# EasyEDA Pro project Space_Hexapod.eprj, schematic SpaceHexapod
Board Name: Board1; Create Date: 2025-01-24
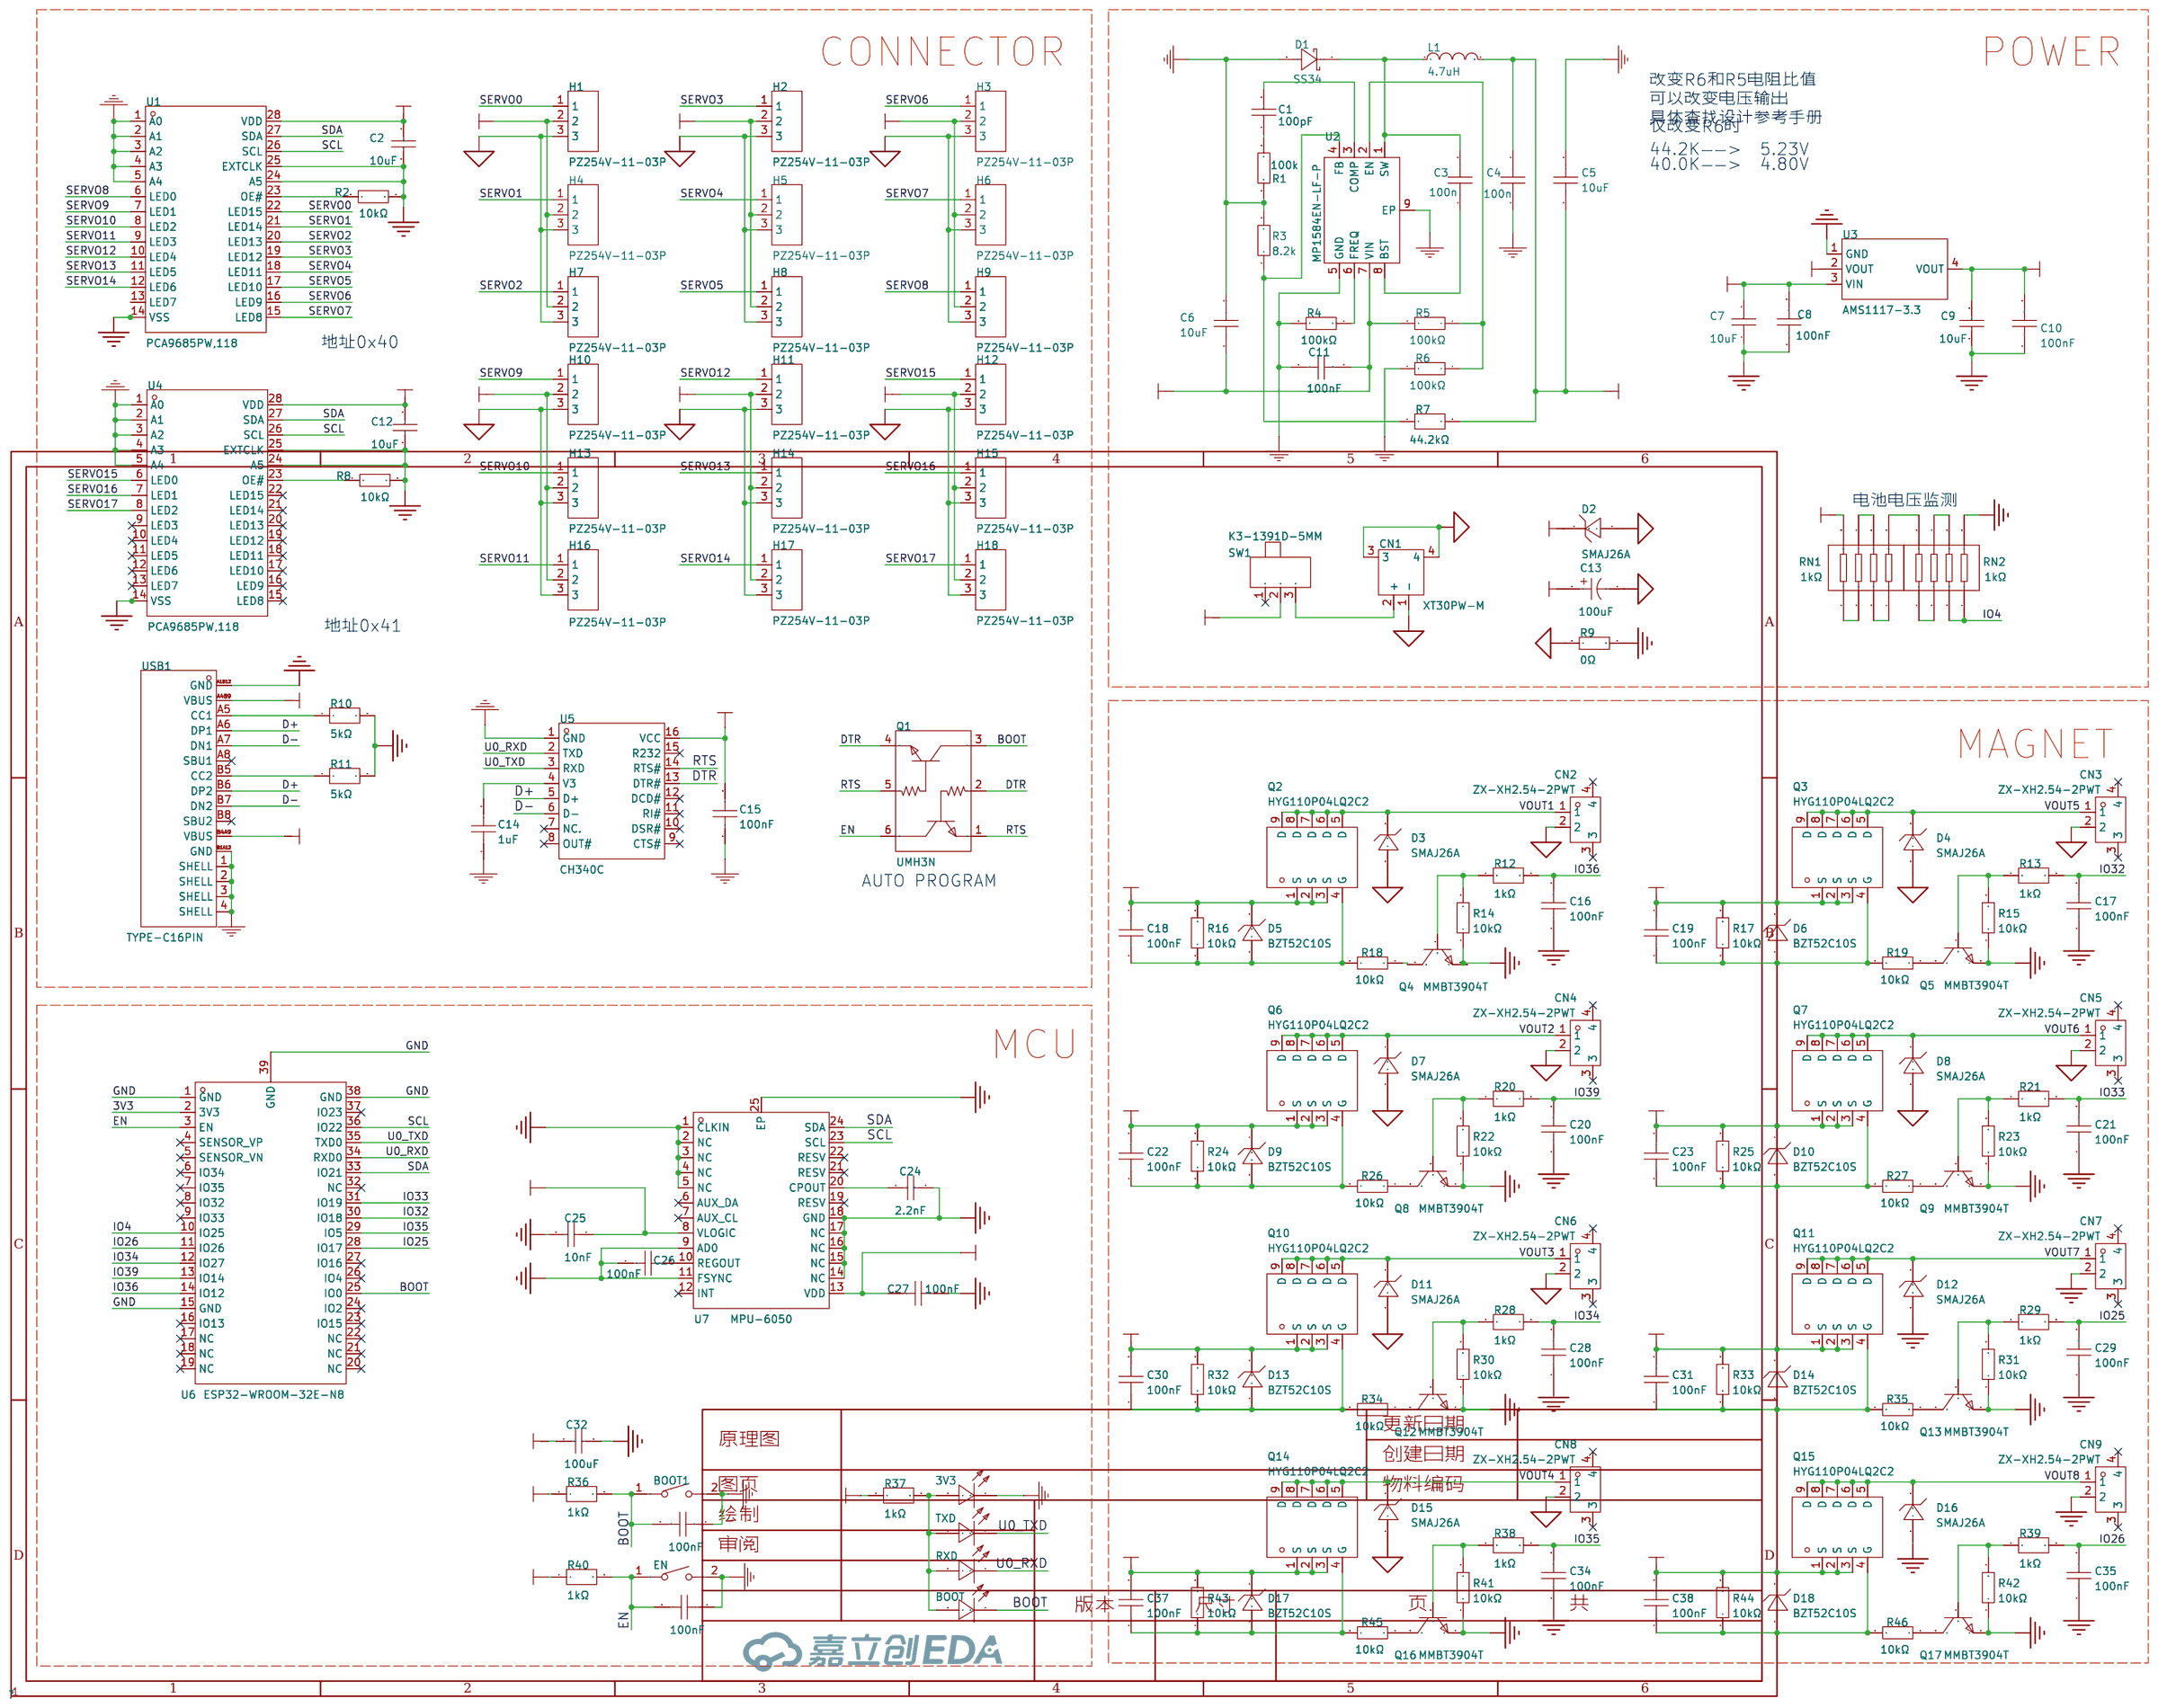
[diagram p0: schematic sheet]

## Parts
3V3  NCD0402G1  [LED0402-RD]
BOOT  NCD0402G1  [LED0402-RD]
BOOT1  TS-1088-AR02016  [SW-SMD_L3.9-W3.0-P4.45]
C1  100pF  [C0402]
C2  10uF  [C0402]
C3  100n  [C0402]
C4  100n  [C0402]
C5  10uF  [C1206]
C6  10uF  [C1206]
C7  10uF  [C0402]
C8  100nF  [C0402]
C9  10uF  [C0402]
C10  100nF  [C0402]
C11  100nF  [C0402]
C12  10uF  [C0402]
C13  100uF  [CAP-SMD_BD6.3-L6.6-W6.6-LS7.6-FD-1]
C14  1uF  [C0402]
C15  100nF  [C0402]
C16  100nF  [C0402]
C17  100nF  [C0402]
C18  100nF  [C0402]
C19  100nF  [C0402]
C20  100nF  [C0402]
C21  100nF  [C0402]
C22  100nF  [C0402]
C23  100nF  [C0402]
C24  2.2nF  [C0402]
C25  10nF  [C0402]
C26  100nF  [C0402]
C27  100nF  [C0402]
C28  100nF  [C0402]
C29  100nF  [C0402]
C30  100nF  [C0402]
C31  100nF  [C0402]
C32  100uF  [C1206]
C33  100nF  [C0402]
C34  100nF  [C0402]
C35  100nF  [C0402]
C36  100nF  [C0402]
C37  100nF  [C0402]
C38  100nF  [C0402]
CN1  XT30PW-M  [CONN-TH_XT30PW-M]
CN2  ZX-XH2.54-2PWT  [CONN-SMD_2P-P2.54_MEGASTAR_ZX-XH2.54-2PWT]
CN3  ZX-XH2.54-2PWT  [CONN-SMD_2P-P2.54_MEGASTAR_ZX-XH2.54-2PWT]
CN4  ZX-XH2.54-2PWT  [CONN-SMD_2P-P2.54_MEGASTAR_ZX-XH2.54-2PWT]
CN5  ZX-XH2.54-2PWT  [CONN-SMD_2P-P2.54_MEGASTAR_ZX-XH2.54-2PWT]
CN6  ZX-XH2.54-2PWT  [CONN-SMD_2P-P2.54_MEGASTAR_ZX-XH2.54-2PWT]
CN7  ZX-XH2.54-2PWT  [CONN-SMD_2P-P2.54_MEGASTAR_ZX-XH2.54-2PWT]
CN8  ZX-XH2.54-2PWT  [CONN-SMD_2P-P2.54_MEGASTAR_ZX-XH2.54-2PWT]
CN9  ZX-XH2.54-2PWT  [CONN-SMD_2P-P2.54_MEGASTAR_ZX-XH2.54-2PWT]
D1  SS34  [SMA_L4.2-W2.7-LS5.0-RD]
D2  SMAJ26A  [SMA_L4.3-W2.6-LS5.1-RD]
D3  SMAJ26A  [SMA_L4.3-W2.6-LS5.1-RD]
D4  SMAJ26A  [SMA_L4.3-W2.6-LS5.1-RD]
D5  BZT52C10S  [SOD-323_L1.6-W1.3-LS2.7-RD]
D6  BZT52C10S  [SOD-323_L1.6-W1.3-LS2.7-RD]
D7  SMAJ26A  [SMA_L4.3-W2.6-LS5.1-RD]
D8  SMAJ26A  [SMA_L4.3-W2.6-LS5.1-RD]
D9  BZT52C10S  [SOD-323_L1.6-W1.3-LS2.7-RD]
D10  BZT52C10S  [SOD-323_L1.6-W1.3-LS2.7-RD]
D11  SMAJ26A  [SMA_L4.3-W2.6-LS5.1-RD]
D12  SMAJ26A  [SMA_L4.3-W2.6-LS5.1-RD]
D13  BZT52C10S  [SOD-323_L1.6-W1.3-LS2.7-RD]
D14  BZT52C10S  [SOD-323_L1.6-W1.3-LS2.7-RD]
D15  SMAJ26A  [SMA_L4.3-W2.6-LS5.1-RD]
D16  SMAJ26A  [SMA_L4.3-W2.6-LS5.1-RD]
D17  BZT52C10S  [SOD-323_L1.6-W1.3-LS2.7-RD]
D18  BZT52C10S  [SOD-323_L1.6-W1.3-LS2.7-RD]
EN  TS-1088-AR02016  [SW-SMD_L3.9-W3.0-P4.45]
H1  PZ254V-11-03P  [HDR-TH_3P-P2.54-V-M]
H2  PZ254V-11-03P  [HDR-TH_3P-P2.54-V-M]
H3  PZ254V-11-03P  [HDR-TH_3P-P2.54-V-M]
H4  PZ254V-11-03P  [HDR-TH_3P-P2.54-V-M]
H5  PZ254V-11-03P  [HDR-TH_3P-P2.54-V-M]
H6  PZ254V-11-03P  [HDR-TH_3P-P2.54-V-M]
H7  PZ254V-11-03P  [HDR-TH_3P-P2.54-V-M]
H8  PZ254V-11-03P  [HDR-TH_3P-P2.54-V-M]
H9  PZ254V-11-03P  [HDR-TH_3P-P2.54-V-M]
H10  PZ254V-11-03P  [HDR-TH_3P-P2.54-V-M]
H11  PZ254V-11-03P  [HDR-TH_3P-P2.54-V-M]
H12  PZ254V-11-03P  [HDR-TH_3P-P2.54-V-M]
H13  PZ254V-11-03P  [HDR-TH_3P-P2.54-V-M]
H14  PZ254V-11-03P  [HDR-TH_3P-P2.54-V-M]
H15  PZ254V-11-03P  [HDR-TH_3P-P2.54-V-M]
H16  PZ254V-11-03P  [HDR-TH_3P-P2.54-V-M]
H17  PZ254V-11-03P  [HDR-TH_3P-P2.54-V-M]
H18  PZ254V-11-03P  [HDR-TH_3P-P2.54-V-M]
L1  4.7uH  [IND-SMD_L5.9-W5.2]
Q1  UMH3N  [SC-70-6_L2.2-W1.3-P0.65-LS2.1-BR]
Q2  HYG110P04LQ2C2  [PDFN-8_L5.2-W5.9-P1.27-LS6.2-BL]
Q3  HYG110P04LQ2C2  [PDFN-8_L5.2-W5.9-P1.27-LS6.2-BL]
Q4  MMBT3904T  [SOT-523-3_L1.6-W0.8-P1.00-LS1.6-BR]
Q5  MMBT3904T  [SOT-523-3_L1.6-W0.8-P1.00-LS1.6-BR]
Q6  HYG110P04LQ2C2  [PDFN-8_L5.2-W5.9-P1.27-LS6.2-BL]
Q7  HYG110P04LQ2C2  [PDFN-8_L5.2-W5.9-P1.27-LS6.2-BL]
Q8  MMBT3904T  [SOT-523-3_L1.6-W0.8-P1.00-LS1.6-BR]
Q9  MMBT3904T  [SOT-523-3_L1.6-W0.8-P1.00-LS1.6-BR]
Q10  HYG110P04LQ2C2  [PDFN-8_L5.2-W5.9-P1.27-LS6.2-BL]
Q11  HYG110P04LQ2C2  [PDFN-8_L5.2-W5.9-P1.27-LS6.2-BL]
Q12  MMBT3904T  [SOT-523-3_L1.6-W0.8-P1.00-LS1.6-BR]
Q13  MMBT3904T  [SOT-523-3_L1.6-W0.8-P1.00-LS1.6-BR]
Q14  HYG110P04LQ2C2  [PDFN-8_L5.2-W5.9-P1.27-LS6.2-BL]
Q15  HYG110P04LQ2C2  [PDFN-8_L5.2-W5.9-P1.27-LS6.2-BL]
Q16  MMBT3904T  [SOT-523-3_L1.6-W0.8-P1.00-LS1.6-BR]
Q17  MMBT3904T  [SOT-523-3_L1.6-W0.8-P1.00-LS1.6-BR]
R1  100k  [R0402]
R2  10kΩ  [R0402]
R3  8.2k  [R0402]
R4  100kΩ  [R0402]
R5  100kΩ  [R0402]
R6  100kΩ  [R0402]
R7  44.2kΩ  [R0402]
R8  10kΩ  [R0402]
R9  0Ω  [R0402]
R10  5kΩ  [R0402]
R11  5kΩ  [R0402]
R12  1kΩ  [R0402]
R13  1kΩ  [R0402]
R14  10kΩ  [R0402]
R15  10kΩ  [R0402]
R16  10kΩ  [R0402]
R17  10kΩ  [R0402]
R18  10kΩ  [R0402]
R19  10kΩ  [R0402]
R20  1kΩ  [R0402]
R21  1kΩ  [R0402]
R22  10kΩ  [R0402]
R23  10kΩ  [R0402]
R24  10kΩ  [R0402]
R25  10kΩ  [R0402]
R26  10kΩ  [R0402]
R27  10kΩ  [R0402]
R28  1kΩ  [R0402]
R29  1kΩ  [R0402]
R30  10kΩ  [R0402]
R31  10kΩ  [R0402]
R32  10kΩ  [R0402]
R33  10kΩ  [R0402]
R34  10kΩ  [R0402]
R35  10kΩ  [R0402]
R36  1kΩ  [R0402]
R37  1kΩ  [R0402]
R38  1kΩ  [R0402]
R39  1kΩ  [R0402]
R40  1kΩ  [R0402]
R41  10kΩ  [R0402]
R42  10kΩ  [R0402]
R43  10kΩ  [R0402]
R44  10kΩ  [R0402]
R45  10kΩ  [R0402]
R46  10kΩ  [R0402]
RN1  1kΩ  [RES-ARRAY-SMD_0603-8P-L3.2-W1.6-BL]
RN2  1kΩ  [RES-ARRAY-SMD_0603-8P-L3.2-W1.6-BL]
RXD  NCD0402G1  [LED0402-RD]
SW1  K3-1391D-5MM  [SW-TH_K3-1391D-5MM]
TXD  NCD0402G1  [LED0402-RD]
U1  PCA9685PW,118  [TSSOP-28_L9.7-W4.4-P0.65-LS6.4-TL]
U2  MP1584EN-LF-P  [SOIC-8_L4.9-W3.9-P1.27-LS6.0-TL-EP-1]
U3  AMS1117-3.3  [SOT-223-3_L6.5-W3.4-P2.30-LS7.0-BR]
U4  PCA9685PW,118  [TSSOP-28_L9.7-W4.4-P0.65-LS6.4-TL]
U5  CH340C  [SOP-16_L10.0-W3.9-P1.27-LS6.0-BL]
U6  ESP32-WROOM-32E-N8  [WIFI-SMD_ESP32-WROOM-32E]
U7  MPU-6050  [QFN-24_L4.0-W4.0-P0.50-BL-EP2.7]
USB1  TYPE-C16PIN  [USB-C-SMD_TYPE-C16PIN]

## Library data of the parts
3V3 BOOT RXD TXD = NCD0402G1: Supplier Part: C130723; Manufacturer: 国星光电; Supplier Footprint: 0402; JLCPCB Part Class: 扩展库; Datasheet: https://atta.szlcsc.com/upload/public/pdf/source/20200820/C130723_D39B4171A1B8D8D2F39C1DC521C0922A.pdf; Supplier: LCSC; Emitted Color: 翠绿色; Forward Voltage (VF): 2.6V~3.6V; Power Dissipation: 72mW; Forward Current: 5mA; Dominant Wavelength: 515nm~530nm; Lens Color: 无色透明透镜; Luminous Intensity: 100mcd~270mcd; Viewing Angle: 130°; Operating Temperature: -30℃~+85℃
BOOT1 EN = TS-1088-AR02016: 电路结构:单刀单掷;按钮形状:圆形按钮;作用力:160gf;安装方式:立贴;开关长度:4mm;开关宽度:3mm;开关高度:2mm;带支架:不带;触点电流:50mA;额定电压(DC):12V;绝缘电阻:100MΩ;机械寿命:10万次;; LCSC Part Name: 4*3*2mm 立贴 轻触开关; Supplier Part: C720477; Manufacturer: XUNPU(讯普); Supplier Footprint: SMD; JLCPCB Part Class: 扩展库; Datasheet: https://atta.szlcsc.com/upload/public/pdf/source/20200810/C720475_60D09DD6C54279ADDB2DC25100F1CC11.pdf; Supplier: LCSC; Circuit: 单刀单掷; Actuator Style: 圆形按钮; Operating Force: 160gf; Mounting Style: 立贴; Switch Length: 4mm; Switch Width: 3mm; Switch Height: 2mm; Strike Gundam: 不带; Contact Current: 50mA; Voltage Rating (DC): 12V; Insulation Resistance: 100MΩ; Actuator/Cap Color: 黑色; Pin Style: SMD接片; Mechanical Life: 10万次; Operating Temperature: -30℃~+80℃
C1 = GRM1555C1H101JA01D: LCSC Part Name: 100pF ±5% 50V; Supplier Part: C77177; Manufacturer: muRata(村田); Supplier Footprint: 0402; JLCPCB Part Class: 扩展库; Datasheet: https://atta.szlcsc.com/upload/public/pdf/source/20161108/1478586482814.pdf; Supplier: LCSC; Tolerance: ±5%; Voltage Rated: 50V; Temperature Coefficient: C0G
C2 C7 C9 C12 = CL05A106MQ5NUNC: 容值:10uF;精度:±20%;额定电压:6.3V;材质(温度系数):X5R;; LCSC Part Name: 10uF ±20% 6.3V; Supplier Part: C15525; Manufacturer: SAMSUNG(三星); Supplier Footprint: 0402; JLCPCB Part Class: 基础库; Datasheet: https://atta.szlcsc.com/upload/public/pdf/source/20220823/2B02EE04F8F211D38A52DCB16EB6BEBA.pdf; Supplier: LCSC; Tolerance: ±20%; Voltage Rated: 6.3V; Temperature Coefficient: X5R
C3 C4 C11 C15-C23 C26-C31 C34 C35 C37 C38 = CL05B104KB54PNC: LCSC Part Name: 100nF ±10% 50V; Supplier Part: C307331; Manufacturer: SAMSUNG(三星); Supplier Footprint: 0402; JLCPCB Part Class: 基础库; Datasheet: https://atta.szlcsc.com/upload/public/pdf/source/20160218/1457707763339.pdf; Supplier: LCSC; Tolerance: ±10%; Voltage Rated: 50V; Temperature Coefficient: X7R
C5 C6 = HGC1206R5106K500NSPJ: LCSC Part Name: 10uF ±10% 50V; Supplier Part: C7432781; Manufacturer: Chinocera(华瓷); Supplier Footprint: 1206; JLCPCB Part Class: 扩展库; Datasheet: https://atta.szlcsc.com/upload/public/pdf/source/20240320/FAC3FEC40A78BC5CCCE96C232A94D860.pdf; Supplier: LCSC; Tolerance: ±10%; Voltage Rating: 50V; Temperature Coefficient: X5R
C8 C10 C33 C36 = CC0402KRX7R7BB104: 容值:100nF;精度:±10%;额定电压:16V;材质(温度系数):X7R;; LCSC Part Name: 100nF ±10% 16V; Supplier Part: C60474; Manufacturer: YAGEO(国巨); Supplier Footprint: 0402; JLCPCB Part Class: 扩展库; Datasheet: https://atta.szlcsc.com/upload/public/pdf/source/20211223/9278FD768280B81DDBEF48FA36411A03.pdf; Supplier: LCSC; Tolerance: ±10%; Voltage Rated: 16V; Temperature Coefficient: X7R
C13 = RVE100UF35V67RV0072: LCSC Part Name: 100uF ±20% 35V; Supplier Part: C2836437; Manufacturer: KNSCHA(科尼盛); Supplier Footprint: SMD,D6.3xL7.7mm; JLCPCB Part Class: 扩展库; Datasheet: https://atta.szlcsc.com/upload/public/pdf/source/20220719/B52EB46F8A1558448ED03D8B4CB3C24F.pdf; Supplier: LCSC; Tolerance: ±20%; Rated Voltage: 35V; Ripple Current: 230mA@120Hz; Equivalent Series Resistance(ESR): 600mΩ@100kHz; φD: 6.3mm; L: 7.7mm; Lifetime @ Temp: 2000hrs@105℃; Operating Temperature: -55℃~+105℃
C14 = GRM155R61H105KE05D: LCSC Part Name: 1uF ±10% 50V; Supplier Part: C1518208; Manufacturer: muRata(村田); Supplier Footprint: 0402; JLCPCB Part Class: 扩展库; Datasheet: https://atta.szlcsc.com/upload/public/pdf/source/20210607/3F03D47137F6EC7729AB4067EB2A6EB3.pdf; Supplier: LCSC; Tolerance: ±10%; Voltage Rated: 50V; Temperature Coefficient: X5R
C24 = CC0402KRX7R9BB222: LCSC Part Name: 2.2nF ±10% 50V; Supplier Part: C106861; Manufacturer: YAGEO(国巨); Supplier Footprint: 0402; JLCPCB Part Class: 扩展库; Datasheet: https://atta.szlcsc.com/upload/public/pdf/source/20170505/1493957848374.pdf; Supplier: LCSC; Tolerance: ±10%; Voltage Rated: 50V; Temperature Coefficient: X7R
C25 = CL05B103KB5NNNC: LCSC Part Name: 10nF ±10% 50V; Supplier Part: C15195; Manufacturer: SAMSUNG(三星); Supplier Footprint: 0402; JLCPCB Part Class: 基础库; Datasheet: https://atta.szlcsc.com/upload/public/pdf/source/20160218/1457707763339.pdf; Supplier: LCSC; Tolerance: ±10%; Voltage Rated: 50V; Temperature Coefficient: X7R
C32 = CL31A107MQHNNNE: LCSC Part Name: 100uF ±20% 6.3V; Supplier Part: C15008; Manufacturer: SAMSUNG(三星); Supplier Footprint: 1206; JLCPCB Part Class: 基础库; Datasheet: https://atta.szlcsc.com/upload/public/pdf/source/20160218/1457707763339.pdf; Supplier: LCSC; Tolerance: ±20%; Voltage Rated: 6.3V; Temperature Coefficient: X5R
CN1 = XT30PW-M: Socket,DCsupply,XT30,male,PIN:2; LCSC Part Name: XT30PW-M公头; Supplier Part: C431092; Manufacturer: AMASS(艾迈斯); Supplier Footprint: 插件; JLCPCB Part Class: 扩展库; Datasheet: https://atta.szlcsc.com/upload/public/pdf/source/20220222/6A9F22F7850E25B33E1BE430ADF8560B.pdf; Supplier: LCSC
CN2-CN9 = ZX-XH2.54-2PWT: LCSC Part Name: 1x2P 间距:2.5mm 卧贴 系列:XH; Supplier Part: C7429671; Manufacturer: Megastar(兆星); Supplier Footprint: SMD,P=2.5mm,卧贴; JLCPCB Part Class: 扩展库; Datasheet: https://atta.szlcsc.com/upload/public/pdf/source/20230619/D2020A0565D707024C90AEAD14B7AF42.pdf; Supplier: LCSC; Pins Structure: 1x2P; Pitch: 2.5mm; Mounting Type: 卧贴; Reference Series: XH; Number of Pins: 2P; Number of Rows: 1; Number of PINs Per Row: 2; Contact Material: 黄铜; Contact Plating: 锡; Supplementary Features: 辅助焊脚; Color: 米色; Z-Height of the Board: 6.2mm; X-Length of Bottom Edge on Board (Spacing Line): 10mm; Y-Width of Bottom Edge on Board: 10.5mm
D1 = SS34_C2891718: LCSC Part Name: 电压:40V 电流:3A; Supplier Part: C2891718; Manufacturer: KUU; Supplier Footprint: SMA(DO-214AC); JLCPCB Part Class: 扩展库; Datasheet: https://atta.szlcsc.com/upload/public/pdf/source/20210901/43FECDC7C0D2D5B6002302D3612B6747.pdf; Supplier: LCSC; Forward Voltage (Vf@If): 550mV@3A; Reverse Voltage (Vr): 40V; Average Rectified Current (Io): 3A; Reverse Leakage Current (Ir): 500uA@40V
D2-D4 D7 D8 D11 D12 D15 D16 = SMAJ26A_C2848697: 反向截止电压(Vrwm):26V;最大钳位电压:42.1V;峰值脉冲电流(Ipp)@10/1000us:9.5A;击穿电压:28.9V;; LCSC Part Name: 单向TVS 26V截止 9.5A峰值脉冲; Supplier Part: C2848697; Manufacturer: GOODWORK(固得沃克); Supplier Footprint: SMA(DO-214AC); JLCPCB Part Class: 扩展库; Datasheet: https://atta.szlcsc.com/upload/public/pdf/source/20201231/C908757_5436EAF671B686EFC2F0DD2098F0ED89.pdf; Supplier: LCSC; Reverse Stand-Off Voltage (Vrwm): 26V; Maximum Clamping Voltage: 42.1V; Peak Pulse Current (Ipp)@10/1000us: 9.5A; Breakdown Voltage: 28.9V; Reverse Leakage Current (Ir): 5uA; Type: TVS; Check: false
D5 D6 D9 D10 D13 D14 D17 D18 = BZT52C10S_C353563: 二极管配置:独立式;稳压值(标称值):10V;稳压值(范围):9.4V~10.6V;功率:200mW;精度:-;; LCSC Part Name: 齐纳二极管 10V 200mW; Supplier Part: C353563; Manufacturer: 晶导微电子; Supplier Footprint: SOD-323; JLCPCB Part Class: 扩展库; Datasheet: https://atta.szlcsc.com/upload/public/pdf/source/20190315/C353563_3561759C765052AF368552CF3A49B126.pdf; Supplier: LCSC; Diode Configuration: 独立式; Zener Voltage (Nom): 10V; Reverse Leakage Current (Ir): 200nA@7V; Zener Voltage (Range): 9.4V~10.6V; Power Dissipation: 200mW; Zener Impedance (Zzt): 20Ω; Check: false
H1-H18 = PZ254V-11-03P: LCSC Part Name: 间距:2.54mm 1x3P 直插 方针; Supplier Part: C2937625; Manufacturer: XFCN(兴飞); Supplier Footprint: 插件,P=2.54mm; JLCPCB Part Class: 扩展库; Datasheet: https://atta.szlcsc.com/upload/public/pdf/source/20200309/C492402_8335C3D49C4E4C618838D59BB1D024C1.pdf; Supplier: LCSC; Pin Structure: 1x3P; Pitch: 2.54mm; Circluar Pins/Square Pins: 方针; Mounting Type: 直插; Number of Rows: 单排; Number of Pins: 3P; Current Rating (Max): 3A; Voltage Rating (Max): 250V; Length of Mating Pin: 6mm; Insulation Height: 2.5mm; Length of End Connection Pin: 3mm; Operating Temperature Range: -40℃~+105℃; Color: 黑色
L1 = MAPM0530F-4R7M-LF: LCSC Part Name: 4.7uH ±20%; Supplier Part: C696442; Manufacturer: microgate(麦捷科技); Supplier Footprint: SMD,5.2x5.9mm; JLCPCB Part Class: 扩展库; Datasheet: https://atta.szlcsc.com/upload/public/pdf/source/20200708/C696439_8685B867A9A56AADDA2217A0E77F6DD4.pdf; Supplier: LCSC; Tolerance: ±20%; Rated Current: 3A; DC Resistance (DCR): 85mΩ
Q1 = UMH3N: LCSC Part Name: 耐压:50V 电流:100mA; Supplier Part: C62892; Manufacturer: CJ(江苏长电/长晶); Supplier Footprint: SC-70-6(SOT-363); JLCPCB Part Class: 扩展库; Datasheet: https://atta.szlcsc.com/upload/public/pdf/source/20151109/1457707575095.pdf; Supplier: LCSC; Collector-Emitter Breakdown Voltage (Vceo): 50V; Collector Current (Ic): 100mA; Power Dissipation (Pd): 150mW; DC Current Gain (hFE@Ic,Vce): 100@1mA,5V; Input Resistor: 6.11kΩ; Operating Temperature: -55℃~+150℃
Q2 Q3 Q6 Q7 Q10 Q11 Q14 Q15 = HYG110P04LQ2C2: 类型:1个P沟道;漏源电压(Vdss):40V;连续漏极电流(Id):55A;功率(Pd):62.5W;导通电阻(RDS(on)@Vgs,Id):9mΩ@10V,20A;阈值电压(Vgs(th)@Id):1.6V@250uA;; LCSC Part Name: 1个P沟道 耐压:40V 电流:55A; Supplier Part: C2891580; Manufacturer: HUAYI(华羿微); Supplier Footprint: PDFN-8(5.9x5.2); JLCPCB Part Class: 扩展库; Datasheet: https://atta.szlcsc.com/upload/public/pdf/source/20210918/C2891580_F8AA530E8886F11C9EBC9E8EFD99D4C1.pdf; Supplier: LCSC; Type: 1个P沟道; Drain Source Voltage (Vdss): 40V; Continuous Drain Current (Id): 55A; Power Dissipation (Pd): 62.5W; Drain Source On Resistance (RDS(on)@Vgs,Id): 9mΩ@10V,20A; Gate Threshold Voltage (Vgs(th)@Id): 1.6V@250uA; Total Gate Charge (Qg@Vgs): 76nC@10V; Input Capacitance (Ciss@Vds): 4.468nF@25V; Reverse Transfer Capacitance (Crss@Vds): 140pF@25V; Operating Temperature: -55℃~+175℃@(Tj); Check: false
Q4 Q5 Q8 Q9 Q12 Q13 Q16 Q17 = MMBT3904T_C61616: 晶体管类型:NPN;集电极电流(Ic):200mA;集射极击穿电压(Vceo):40V;功率(Pd):250mW;; LCSC Part Name: MMBT3904T(RANGE:100-300) 100~300; Supplier Part: C61616; Manufacturer: CJ(江苏长电/长晶); Supplier Footprint: SOT-523-3; JLCPCB Part Class: 扩展库; Datasheet: https://atta.szlcsc.com/upload/public/pdf/source/20160713/1468379853547.pdf; Supplier: LCSC; Transistor Type: NPN; Collector Current (Ic): 200mA; Collector-Emitter Breakdown Voltage (Vceo): 40V; Power Dissipation (Pd): 250mW; Check: false
R1 R4-R6 = 0402WGF1003TCE: LCSC Part Name: 100kΩ ±1% 62.5mW 厚膜电阻; Supplier Part: C25741; Manufacturer: UNI-ROYAL(厚声); Supplier Footprint: 0402; JLCPCB Part Class: 基础库; Datasheet: https://atta.szlcsc.com/upload/public/pdf/source/20200306/C422600_1E6D84923E4A46A82E41ADD87F860B5C.pdf; Supplier: LCSC; Type: 厚膜电阻; Tolerance: ±1%; Power(Watts): 62.5mW; Overload Voltage (Max): 50V; Temperature Coefficient: ±100ppm/℃; Operating Temperature Range: -55℃~+155℃
R2 R8 R14-R19 R22-R27 R30-R35 R41-R46 = 0402WGF1002TCE: LCSC Part Name: 10kΩ ±1% 62.5mW 厚膜电阻; Supplier Part: C25744; Manufacturer: UNI-ROYAL(厚声); Supplier Footprint: 0402; JLCPCB Part Class: 基础库; Datasheet: https://atta.szlcsc.com/upload/public/pdf/source/20200306/C422600_1E6D84923E4A46A82E41ADD87F860B5C.pdf; Supplier: LCSC; Type: 厚膜电阻; Tolerance: ±1%; Power(Watts): 62.5mW; Overload Voltage (Max): 50V; Temperature Coefficient: ±100ppm/℃; Operating Temperature Range: -55℃~+155℃
R3 = 0402WGF8201TCE: LCSC Part Name: 8.2kΩ ±1% 62.5mW 厚膜电阻; Supplier Part: C25924; Manufacturer: UNI-ROYAL(厚声); Supplier Footprint: 0402; JLCPCB Part Class: 扩展库; Datasheet: https://atta.szlcsc.com/upload/public/pdf/source/20200306/C422600_1E6D84923E4A46A82E41ADD87F860B5C.pdf; Supplier: LCSC; Type: 厚膜电阻; Tolerance: ±1%; Power(Watts): 62.5mW; Overload Voltage (Max): 50V; Temperature Coefficient: ±100ppm/℃; Operating Temperature Range: -55℃~+155℃
R7 = FRC0402F4422TS: LCSC Part Name: 44.2kΩ ±1% 62.5mW 厚膜电阻; Supplier Part: C2933098; Manufacturer: FOJAN(富捷); Supplier Footprint: 0402; JLCPCB Part Class: 扩展库; Datasheet: https://atta.szlcsc.com/upload/public/pdf/source/20211221/925EC7D7225764EE0046F22065062C87.pdf; Supplier: LCSC; Type: 厚膜电阻; Tolerance: ±1%; Power(Watts): 62.5mW; Voltage-Supply(Max): 50V; Temperature Coefficient: ±100ppm/℃; Operating Temperature: -55℃~+155℃
R9 = 0402WGF0000TCE: LCSC Part Name: 0Ω ±1% 62.5mW 厚膜电阻; Supplier Part: C17168; Manufacturer: UNI-ROYAL(厚声); Supplier Footprint: 0402; JLCPCB Part Class: 基础库; Datasheet: https://atta.szlcsc.com/upload/public/pdf/source/20200306/C422600_1E6D84923E4A46A82E41ADD87F860B5C.pdf; Supplier: LCSC; Type: 厚膜电阻; Tolerance: ±1%; Power(Watts): 62.5mW; Overload Voltage (Max): 50V; Temperature Coefficient: ±800ppm/℃; Operating Temperature Range: -55℃~+155℃
R10 R11 = RC0402FR-075KL: LCSC Part Name: 厚膜电阻 5kΩ ±1% 62.5mW; Supplier Part: C477765; Manufacturer: YAGEO(国巨); Supplier Footprint: 0402; JLCPCB Part Class: 扩展库; Datasheet: https://atta.szlcsc.com/upload/public/pdf/source/20200715/C477765_7B5FC8325F065A7C97D0E958BF6567D2.pdf; Supplier: LCSC; Type: 厚膜电阻; Tolerance: ±1%; Power(Watts): 62.5mW; Overload Voltage (Max): 50V; Temperature Coefficient: ±100ppm/℃; Operating Temperature Range: -55℃~+155℃
R12 R13 R20 R21 R28 R29 R36-R40 = RT0402BRD071KL: LCSC Part Name: 薄膜电阻 1kΩ ±0.1% 62.5mW; Supplier Part: C852624; Manufacturer: YAGEO(国巨); Supplier Footprint: 0402; JLCPCB Part Class: 扩展库; Datasheet: https://atta.szlcsc.com/upload/public/pdf/source/20210609/C852624_9EB141A274604F87C6BB037C8019D50A.pdf; Supplier: LCSC; Type: 薄膜电阻; Tolerance: ±0.1%; Power(Watts): 62.5mW; Overload Voltage (Max): 50V; Temperature Coefficient: ±25ppm/℃; Operating Temperature Range: -55℃~+155℃
RN1 RN2 = RC-ML08W102JT: LCSC Part Name: 1kΩ ±5%; Supplier Part: C160614; Manufacturer: FH(风华); Supplier Footprint: 0603x4; JLCPCB Part Class: 扩展库; Datasheet: https://atta.szlcsc.com/upload/public/pdf/source/20140224/1457706855019.pdf; Supplier: LCSC; Number of Resistors: 4; Tolerance: ±5%; Power(Watts): 62.5mW; Temperature Coefficient: ±100ppm/℃; Number of Pins: 8
SW1 = K3-1391D-5MM: LCSC Part Name: 直插双档 滑动开关; Supplier Part: C970579; Manufacturer: 韩国韩荣; Supplier Footprint: 插件; JLCPCB Part Class: 扩展库; Datasheet: https://atta.szlcsc.com/upload/public/pdf/source/20201211/C970579_603CDB6D9DEEEE4ED10454FCD9A65E24.pdf; Supplier: LCSC; Circuit: 单刀双掷; Actuator Style: 矩形柱状; Pin Style: PC引脚; Switch Length: 13.3mm; Switch Width: 6mm; Switch Height: 6.6mm; Mounting Style: 直插; Actuator Color: 黑色; Current Rating (AC): 3A; Voltage Rating (AC): 120V; Mechanical Life: 3万次; Operating Temperature: -25℃~+80℃
U1 U4 = PCA9685PW,118: Supplier Part: C2678753; Manufacturer: NXP(恩智浦); Supplier Footprint: TSSOP-28; JLCPCB Part Class: 扩展库; Datasheet: https://atta.szlcsc.com/upload/public/pdf/source/20170908/C92206_1504870161626958140.pdf; Supplier: LCSC; Input Voltage: 2.3V~5.5V; Switch Frequency: 100kHz~1MHz; Channels: 16; Output Voltage: 5.5V; Output Current: 25mA; Dimming: PWM; Operating temperature: -40℃~+85℃
U2 = MP1584EN-LF-P: LCSC Part Name: 3A，1.5MHz，28V降压转换器; Supplier Part: C7304223; Manufacturer: MPS(芯源); Supplier Footprint: SOIC-8-EP; JLCPCB Part Class: 扩展库; Datasheet: https://atta.szlcsc.com/upload/public/pdf/source/20240130/9891F7686D244BAC2C15FBD735CECA53.pdf; Supplier: LCSC; Function: 降压型; Output Type: 可调; Input Voltage: 4.5V~28V; Output Voltage: 800mV~25V; Output Current: 3A; Switching Frequency: 1.5MHz; Operating Temperature: -20℃~+125℃@(TJ); Synchronous Rectification: 否; Number of Outputs: 1; Topology: 降压式; Switch tube (built-in/external): 内置
U3 = AMS1117-3.3_C6186: 输出类型:固定;最大输入电压:-;输出电压:3.3V;最大输出电流:1A;电源纹波抑制比(PSRR):72dB@(120Hz);输出极性:正极;; LCSC Part Name: 输出3.3V 1A; Supplier Part: C6186; Manufacturer: AMS; Supplier Footprint: SOT-223; JLCPCB Part Class: 基础库; Datasheet: https://atta.szlcsc.com/upload/public/pdf/source/20180727/C6186_7A095716F0823C02F1997A905E26C086.pdf; Supplier: LCSC; Output Type: 固定; Output Voltage: 3.3V; MAX Output Current: 1A; Power Supply Rejection Ratio (PSRR): 72dB@(120Hz); Dropout Voltage: 1.3V@(800mA); Output Polarity: 正极; Number of Outputs: 1
U5 = CH340C: LCSC Part Name: CH340C USB转串口芯片 CH340; Supplier Part: C84681; Manufacturer: WCH(南京沁恒); Supplier Footprint: SOP-16; JLCPCB Part Class: 扩展库; Datasheet: https://atta.szlcsc.com/upload/public/pdf/source/20240619/63986D8440D4E5267A77ACD891CC4DE3.pdf; Supplier: LCSC; Applications Function: 收发器; Protocol: USB 2.0; Supply Voltage: 3.3V；5V; Data Rate: 2Mbps
U6 = ESP32-WROOM-32E-N8: LCSC Part Name: 通用型Wi-Fi+BT+BLE MCU模组; Supplier Part: C701342; Manufacturer: ESPRESSIF(乐鑫); Supplier Footprint: SMD,18x25.5mm; JLCPCB Part Class: 扩展库; Datasheet: https://atta.szlcsc.com/upload/public/pdf/source/20240307/DEBA00FAE5BA634F0D73085E4F214E93.pdf; Supplier: LCSC
U7 = MPU-6050: Supplier Part: C24112; Manufacturer: TDK InvenSense(应美盛); Supplier Footprint: QFN-24-EP(4x4); JLCPCB Part Class: 扩展库; Datasheet: https://atta.szlcsc.com/upload/public/pdf/source/20140425/1457707046159.pdf; Supplier: LCSC; Sensor Type: 加速度计陀螺仪; Operating Temperature: -40℃~+85℃
USB1 = TYPE-C16PIN: LCSC Part Name: Type-C 母 卧贴; Supplier Part: C393939; Manufacturer: SHOU HAN(首韩); Supplier Footprint: SMD; JLCPCB Part Class: 扩展库; Datasheet: https://atta.szlcsc.com/upload/public/pdf/source/20190521/C393939_7B9043D4CF1026AF443AB60D91FBCD5C.pdf; Supplier: LCSC; Connector Type: Type-C; Standard: USB 3.1; Gender: 母; Mounting Style: 卧贴; Number of Contacts: 16P; Number of Ports: 1; Current Rating - Power (Max): 3A; Operating Temperature Range: -40℃~+85℃; Rated Voltage (Max): 30V; Connect-Disconnect Life: 1万次; Core Colour: 黑色

## Nets
3V3: C2.2 C9.2 C10.2 C12.2 C15.2 C25.1 C27.2 C32.1 R36.1 R37.1 R40.1 U1.28(VDD) U3.2(VOUT) U3.4(VOUT) U4.28(VDD) U5.16(VCC) U6.2(3V3) U7.8(VLOGIC) U7.13(VDD)
5V: C4.2 C5.1 C7.2 C8.2 H1.2 H2.2 H3.2 H4.2 H5.2 H6.2 H7.2 H8.2 H9.2 H10.2 H11.2 H12.2 H13.2 H14.2 H15.2 H16.2 H17.2 H18.2 L1.2 R7.2 U3.3(VIN) USB1.A4B9(VBUS) USB1.B4A9(VBUS)
GND: 3V3.1(K) BOOT1.2 C2.1 C4.1 C5.2 C6.2 C7.1 C8.1 C9.1 C10.1 C11.1 C12.1 C14.1 C15.1 C16.1 C17.1 C20.1 C21.1 C24.2 C25.2 C26.1 C27.1 C28.1 C29.1 C32.2 C33.1 C34.1 C35.1 C36.1 CN7.2 CN9.2 D1.2(A) D12.2(A) D16.2(A) EN.2 Q4.2(E) Q5.2(E) Q8.2(E) Q9.2(E) Q12.2(E) Q13.2(E) Q16.2(E) Q17.2(E) R1.2 R2.2 R3.2 R4.2 R6.2 R8.2 R9.2 R10.2 R11.2 R14.1 R15.1 R22.1 R23.1 R30.1 R31.1 R41.1 R42.1 RN2.5 U1.1(A0) U1.2(A1) U1.3(A2) U1.4(A3) U1.5(A4) U1.14(VSS) U1.24(A5) U1.25(EXTCLK) U2.5(GND) U2.9(EP) U3.1(GND) U4.1(A0) U4.2(A1) U4.3(A2) U4.4(A3) U4.5(A4) U4.14(VSS) U4.24(A5) U4.25(EXTCLK) U5.1(GND) U6.1(GND) U6.15(GND) U6.38(GND) U6.39(GND) U7.1(CLKIN) U7.2(NC) U7.3(NC) U7.4(NC) U7.5(NC) U7.9(AD0) U7.11(FSYNC) U7.14(NC) U7.15(NC) U7.16(NC) U7.17(NC) U7.18(GND) U7.25(EP) USB1.1(SHELL) USB1.2(SHELL) USB1.3(SHELL) USB1.4(SHELL) USB1.A1B12(GND) USB1.B1A12(GND)
PGND: C13.2 CN1.1(-) CN1.3 CN1.4 CN2.2 CN3.2 CN4.2 CN5.2 CN6.2 CN8.2 D2.2(A) D3.2(A) D4.2(A) D7.2(A) D8.2(A) D11.2(A) D15.2(A) H1.3 H2.3 H3.3 H4.3 H5.3 H6.3 H7.3 H8.3 H9.3 H10.3 H11.3 H12.3 H13.3 H14.3 H15.3 H16.3 H17.3 H18.3 R9.1
VIN: C6.1 C11.2 C13.1 C18.2 C19.2 C22.2 C23.2 C30.2 C31.2 C37.2 C38.2 D2.1(C) D5.1(C) D6.1(C) D9.1(C) D10.1(C) D13.1(C) D14.1(C) D17.1(C) D18.1(C) Q2.1(S) Q2.2(S) Q2.3(S) Q3.1(S) Q3.2(S) Q3.3(S) Q6.1(S) Q6.2(S) Q6.3(S) Q7.1(S) Q7.2(S) Q7.3(S) Q10.1(S) Q10.2(S) Q10.3(S) Q11.1(S) Q11.2(S) Q11.3(S) Q14.1(S) Q14.2(S) Q14.3(S) Q15.1(S) Q15.2(S) Q15.3(S) R5.2 R16.2 R17.2 R24.2 R25.2 R32.2 R33.2 R43.2 R44.2 RN1.8 SW1.2 U2.7(VIN)
BOOT: BOOT.1(K) BOOT1.1 C33.2 Q1.3(C) R36.2 U6.25(IO0)
D+: U5.5(D+) USB1.A6(DP1) USB1.B6(DP2)
D-: U5.6(D-) USB1.A7(DN1) USB1.B7(DN2)
DTR: Q1.2(B) Q1.4(E) U5.13(DTR#)
EN: C36.2 EN.1 Q1.6(C) R40.2 U6.3(EN)
IO4: RN2.3 RN2.4 U6.10(IO25)
IO25: C29.2 R29.2 U6.28(IO17)
IO26: C35.2 R39.2 U6.11(IO26)
IO32: C17.2 R13.2 U6.30(IO18)
IO33: C21.2 R21.2 U6.31(IO19)
IO34: C28.2 R28.2 U6.12(IO27)
IO35: C34.2 R38.2 U6.29(IO5)
IO36: C16.2 R12.2 U6.14(IO12)
IO39: C20.2 R20.2 U6.13(IO14)
RTS: Q1.1(E) Q1.5(B) U5.14(RTS#)
SCL: U1.26(SCL) U4.26(SCL) U6.36(IO22) U7.23(SCL)
SDA: U1.27(SDA) U4.27(SDA) U6.33(IO21) U7.24(SDA)
SERVO0: H1.1 U1.22(LED15)
SERVO1: H4.1 U1.21(LED14)
SERVO2: H7.1 U1.20(LED13)
SERVO3: H2.1 U1.19(LED12)
SERVO4: H5.1 U1.18(LED11)
SERVO5: H8.1 U1.17(LED10)
SERVO6: H3.1 U1.16(LED9)
SERVO7: H6.1 U1.15(LED8)
SERVO8: H9.1 U1.6(LED0)
SERVO9: H10.1 U1.7(LED1)
SERVO10: H13.1 U1.8(LED2)
SERVO11: H16.1 U1.9(LED3)
SERVO12: H11.1 U1.10(LED4)
SERVO13: H14.1 U1.11(LED5)
SERVO14: H17.1 U1.12(LED6)
SERVO15: H12.1 U4.6(LED0)
SERVO16: H15.1 U4.7(LED1)
SERVO17: H18.1 U4.8(LED2)
U0_RXD: RXD.1(K) U5.2(TXD) U6.34(RXD0)
U0_TXD: TXD.1(K) U5.3(RXD) U6.35(TXD0)
VOUT1: CN2.1 D3.1(C) Q2.5(D) Q2.6(D) Q2.7(D) Q2.8(D) Q2.9(D)
VOUT2: CN4.1 D7.1(C) Q6.5(D) Q6.6(D) Q6.7(D) Q6.8(D) Q6.9(D)
VOUT3: CN6.1 D11.1(C) Q10.5(D) Q10.6(D) Q10.7(D) Q10.8(D) Q10.9(D)
VOUT4: CN8.1 D15.1(C) Q14.5(D) Q14.6(D) Q14.7(D) Q14.8(D) Q14.9(D)
VOUT5: CN3.1 D4.1(C) Q3.5(D) Q3.6(D) Q3.7(D) Q3.8(D) Q3.9(D)
VOUT6: CN5.1 D8.1(C) Q7.5(D) Q7.6(D) Q7.7(D) Q7.8(D) Q7.9(D)
VOUT7: CN7.1 D12.1(C) Q11.5(D) Q11.6(D) Q11.7(D) Q11.8(D) Q11.9(D)
VOUT8: CN9.1 D16.1(C) Q15.5(D) Q15.6(D) Q15.7(D) Q15.8(D) Q15.9(D)
$1N5663: R10.1 USB1.A5(CC1)
$1N5825: R11.1 USB1.B5(CC2)
$1N9225: R2.1 U1.23(OE#)
$1N11453: C24.1 U7.20(CPOUT)
$1N12575: C14.2 U5.4(V3)
$1N38845: C18.1 D5.2(A) Q2.4(G) R16.1 R18.2
$1N38859: Q4.1(B) R12.1 R14.2
$1N41287: C3.2 D1.1(K) L1.1 U2.1(SW)
$1N41288: R5.1 R6.1 U2.2(EN)
$1N41290: C1.2 U2.3(COMP)
$1N41291: C1.1 R1.1
$1N41292: R3.1 R7.1 U2.4(FB)
$1N41293: C3.1 U2.8(BST)
$1N41296: R4.1 U2.6(FREQ)
$1N41309: CN1.2(+) SW1.3
$1N45172: R8.1 U4.23(OE#)
$1N60250: Q5.1(B) R13.1 R15.2
$1N60800: C22.1 D9.2(A) Q6.4(G) R24.1 R26.2
$1N60819: Q8.1(B) R20.1 R22.2
$1N61369: C23.1 D10.2(A) Q7.4(G) R25.1 R27.2
$1N61388: Q9.1(B) R21.1 R23.2
$1N61938: C30.1 D13.2(A) Q10.4(G) R32.1 R34.2
$1N61957: Q12.1(B) R28.1 R30.2
$1N62507: C31.1 D14.2(A) Q11.4(G) R33.1 R35.2
$1N62526: Q13.1(B) R29.1 R31.2
$1N63076: C37.1 D17.2(A) Q14.4(G) R43.1 R45.2
$1N63095: Q16.1(B) R38.1 R41.2
$1N63645: C38.1 D18.2(A) Q15.4(G) R44.1 R46.2
$1N63664: Q17.1(B) R39.1 R42.2
$1N80892: RN1.1 RN1.2
$1N80896: RN1.6 RN1.7
$1N80957: RN2.6 RN2.7
$1N80959: RN2.1 RN2.2
$1N80966: RN1.5 RN2.8
$1N80970: RN1.3 RN1.4
$1N81207: 3V3.2(A) BOOT.2(A) R37.2 RXD.2(A) TXD.2(A)
$1N103599: C19.1 D6.2(A) Q3.4(G) R17.1 R19.2
$1N103817: Q8.3(C) R26.1
$1N104041: Q12.3(C) R34.1
$1N104265: Q16.3(C) R45.1
$1N104489: Q5.3(C) R19.1
$1N104713: Q9.3(C) R27.1
$1N104937: Q13.3(C) R35.1
$1N105161: Q17.3(C) R46.1
$1N105996: Q4.3(C) R18.1
$1N116707: C26.2 U7.10(REGOUT)

Not connected (* = marked no-connect by the designer): CN2 3* 4*; CN3 3* 4*; CN4 3* 4*; CN5 3* 4*; CN6 3* 4*; CN7 3* 4*; CN8 3* 4*; CN9 3* 4*; SW1 1*; U1 13(LED7); U4 9(LED3)* 10(LED4)* 11(LED5)* 12(LED6)* 13(LED7)* 15(LED8)* 16(LED9)* 17(LED10)* 18(LED11)* 19(LED12)* 20(LED13)* 21(LED14)* 22(LED15)*; U5 7(NC.)* 8(OUT#)* 9(CTS#)* 10(DSR#)* 11(RI#)* 12(DCD#)* 15(R232)*; U6 4(SENSOR_VP)* 5(SENSOR_VN)* 6(IO34)* 7(IO35)* 8(IO32)* 9(IO33)* 16(IO13)* 17(NC)* 18(NC)* 19(NC)* 20(NC)* 21(NC)* 22(NC)* 23(IO15)* 24(IO2)* 26(IO4)* 27(IO16)* 32(NC)* 37(IO23)*; U7 6(AUX_DA)* 7(AUX_CL)* 12(INT)* 19(RESV)* 21(RESV)* 22(RESV)*; USB1 A8(SBU1)* B8(SBU2)*

## Notes on the sheet
- CONNECTOR
- 改变R6和R5电阻比值
  可以改变电压输出
  具体查找设计参考手册
- POWER
- 仅改变R6时
- 44.2K——>  5.23V
- 40.0K——>  4.80V
- 地址0x40
- 电池电压监测
- 地址0x41
- MAGNET
- AUTO PROGRAM
- MCU
